# EAGLE schematic SchematicControlPlotter (EAGLE 9.1.2)
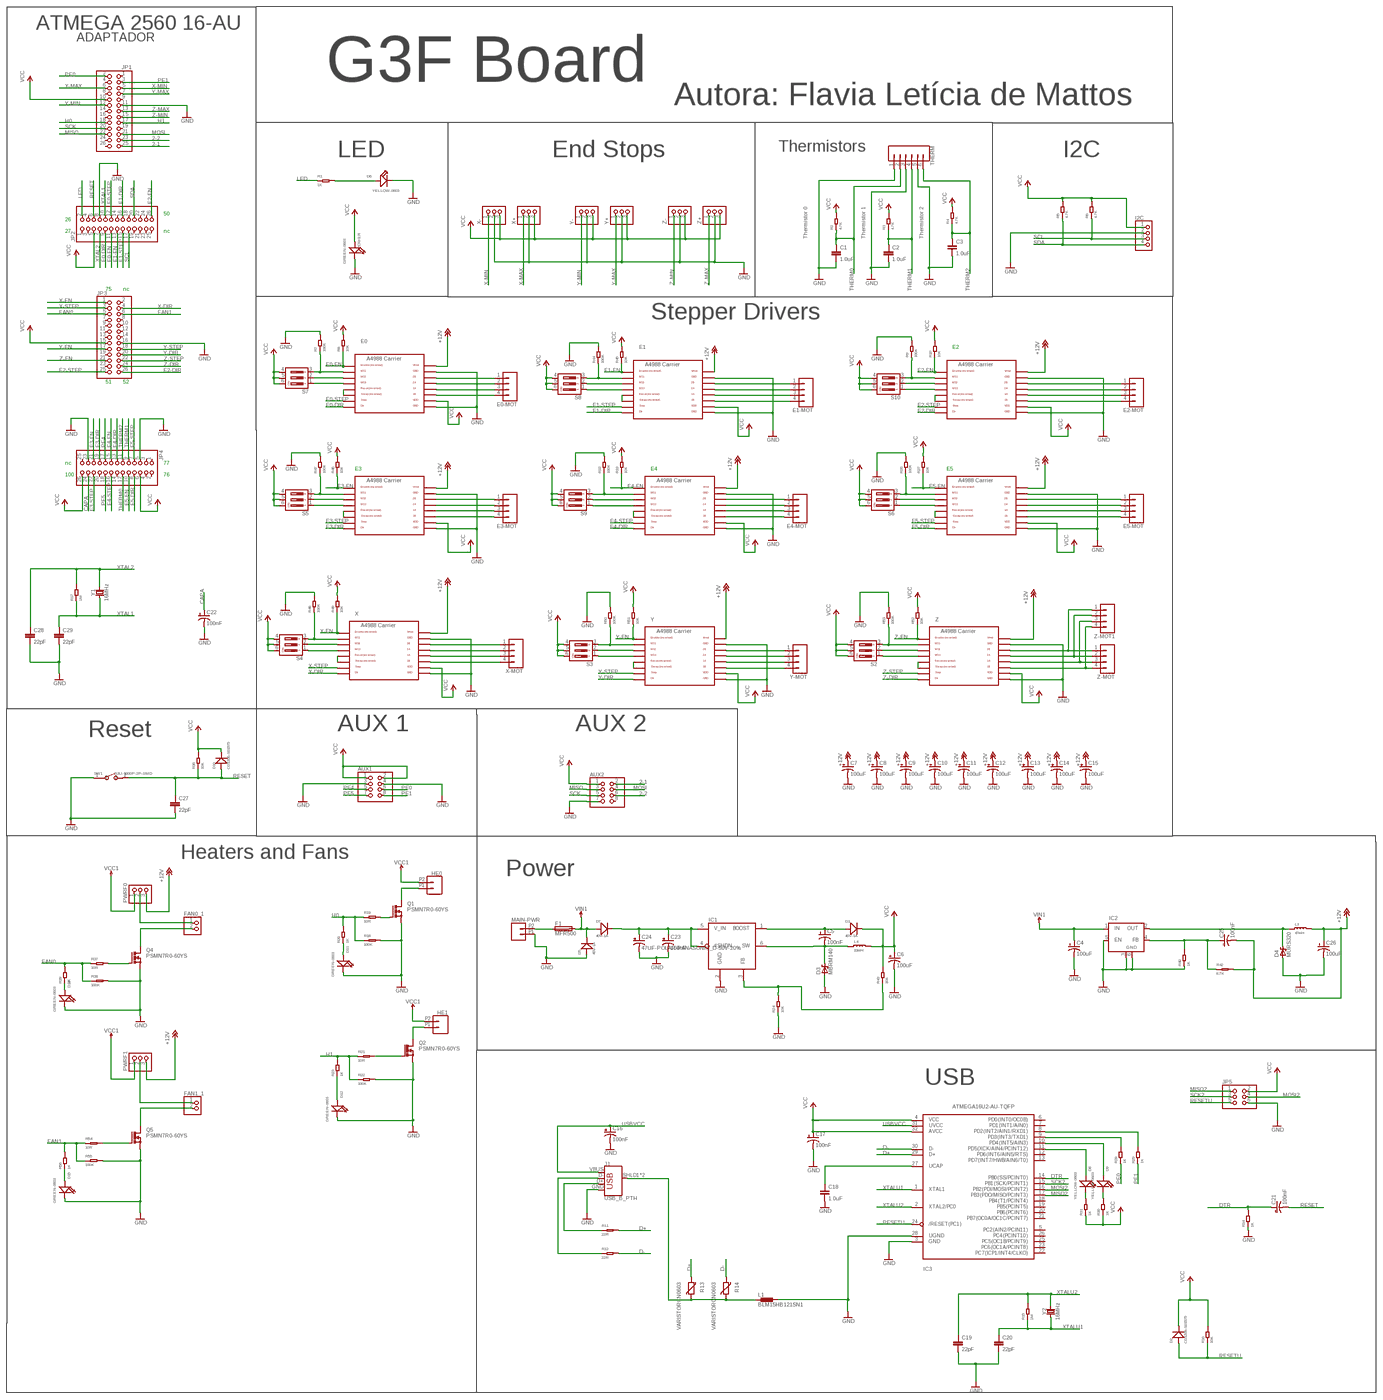
[diagram p0: schematic, sheet 1, overview]
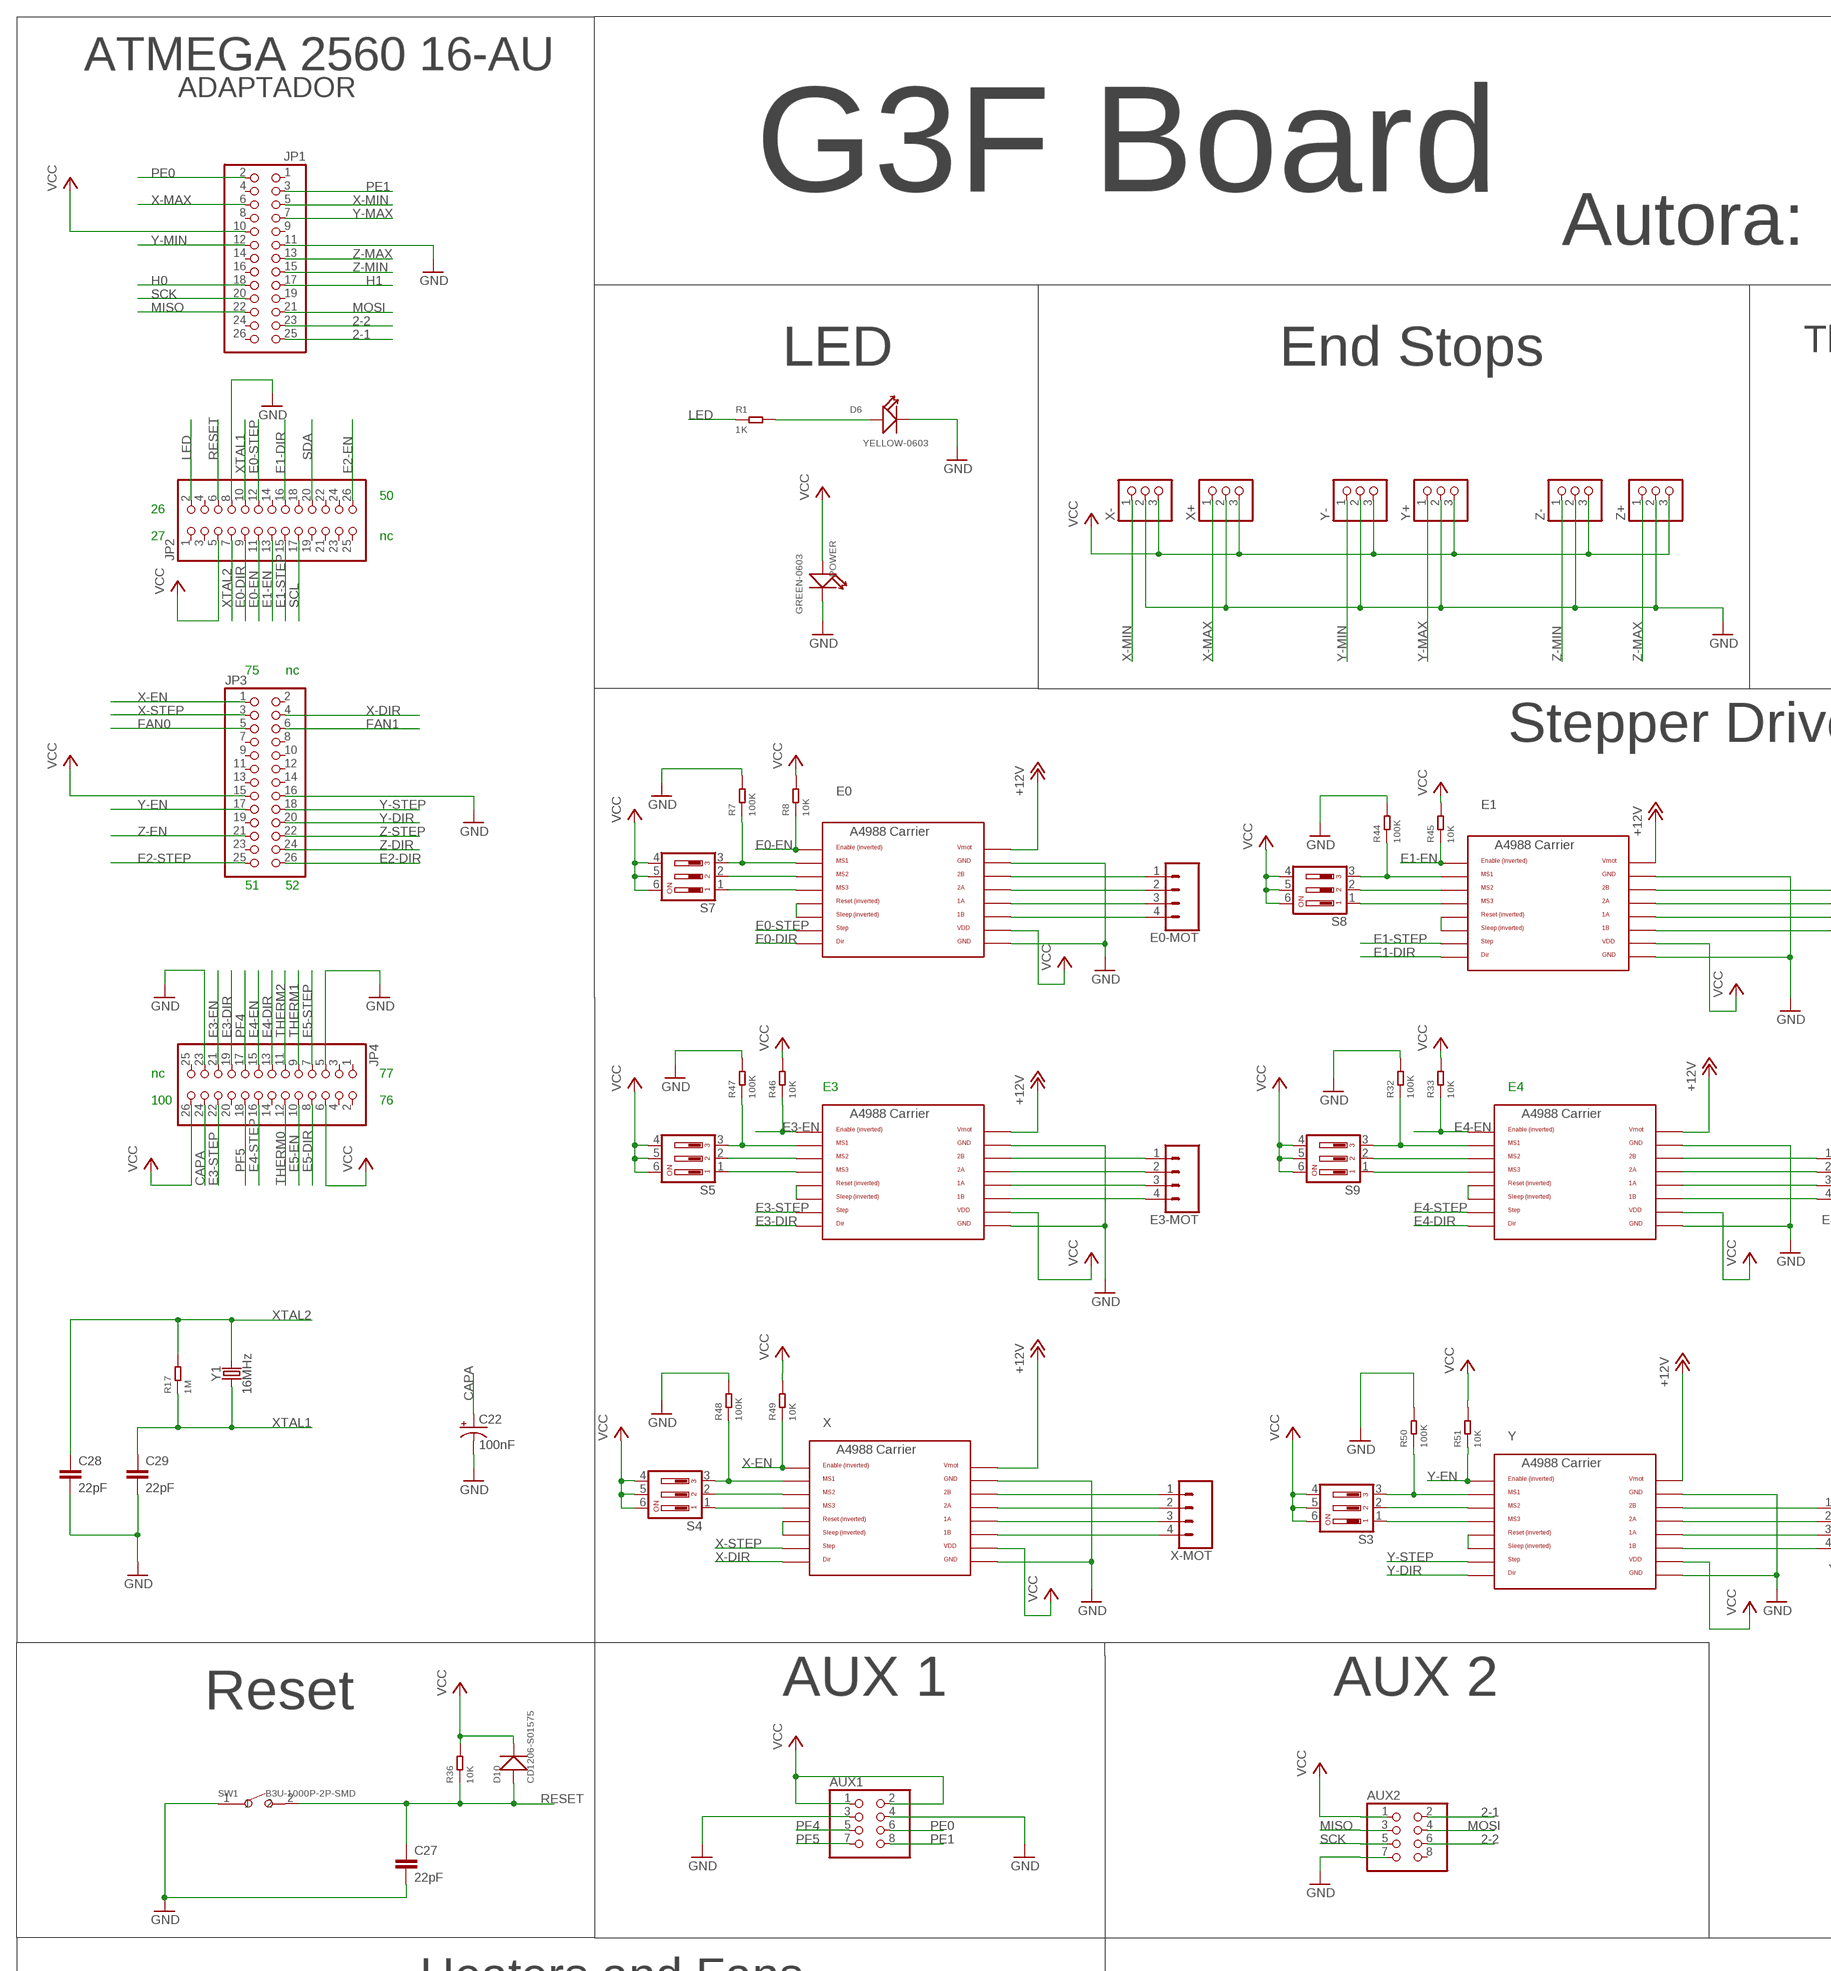
[diagram p1: schematic, sheet 1, part 1 of 4]
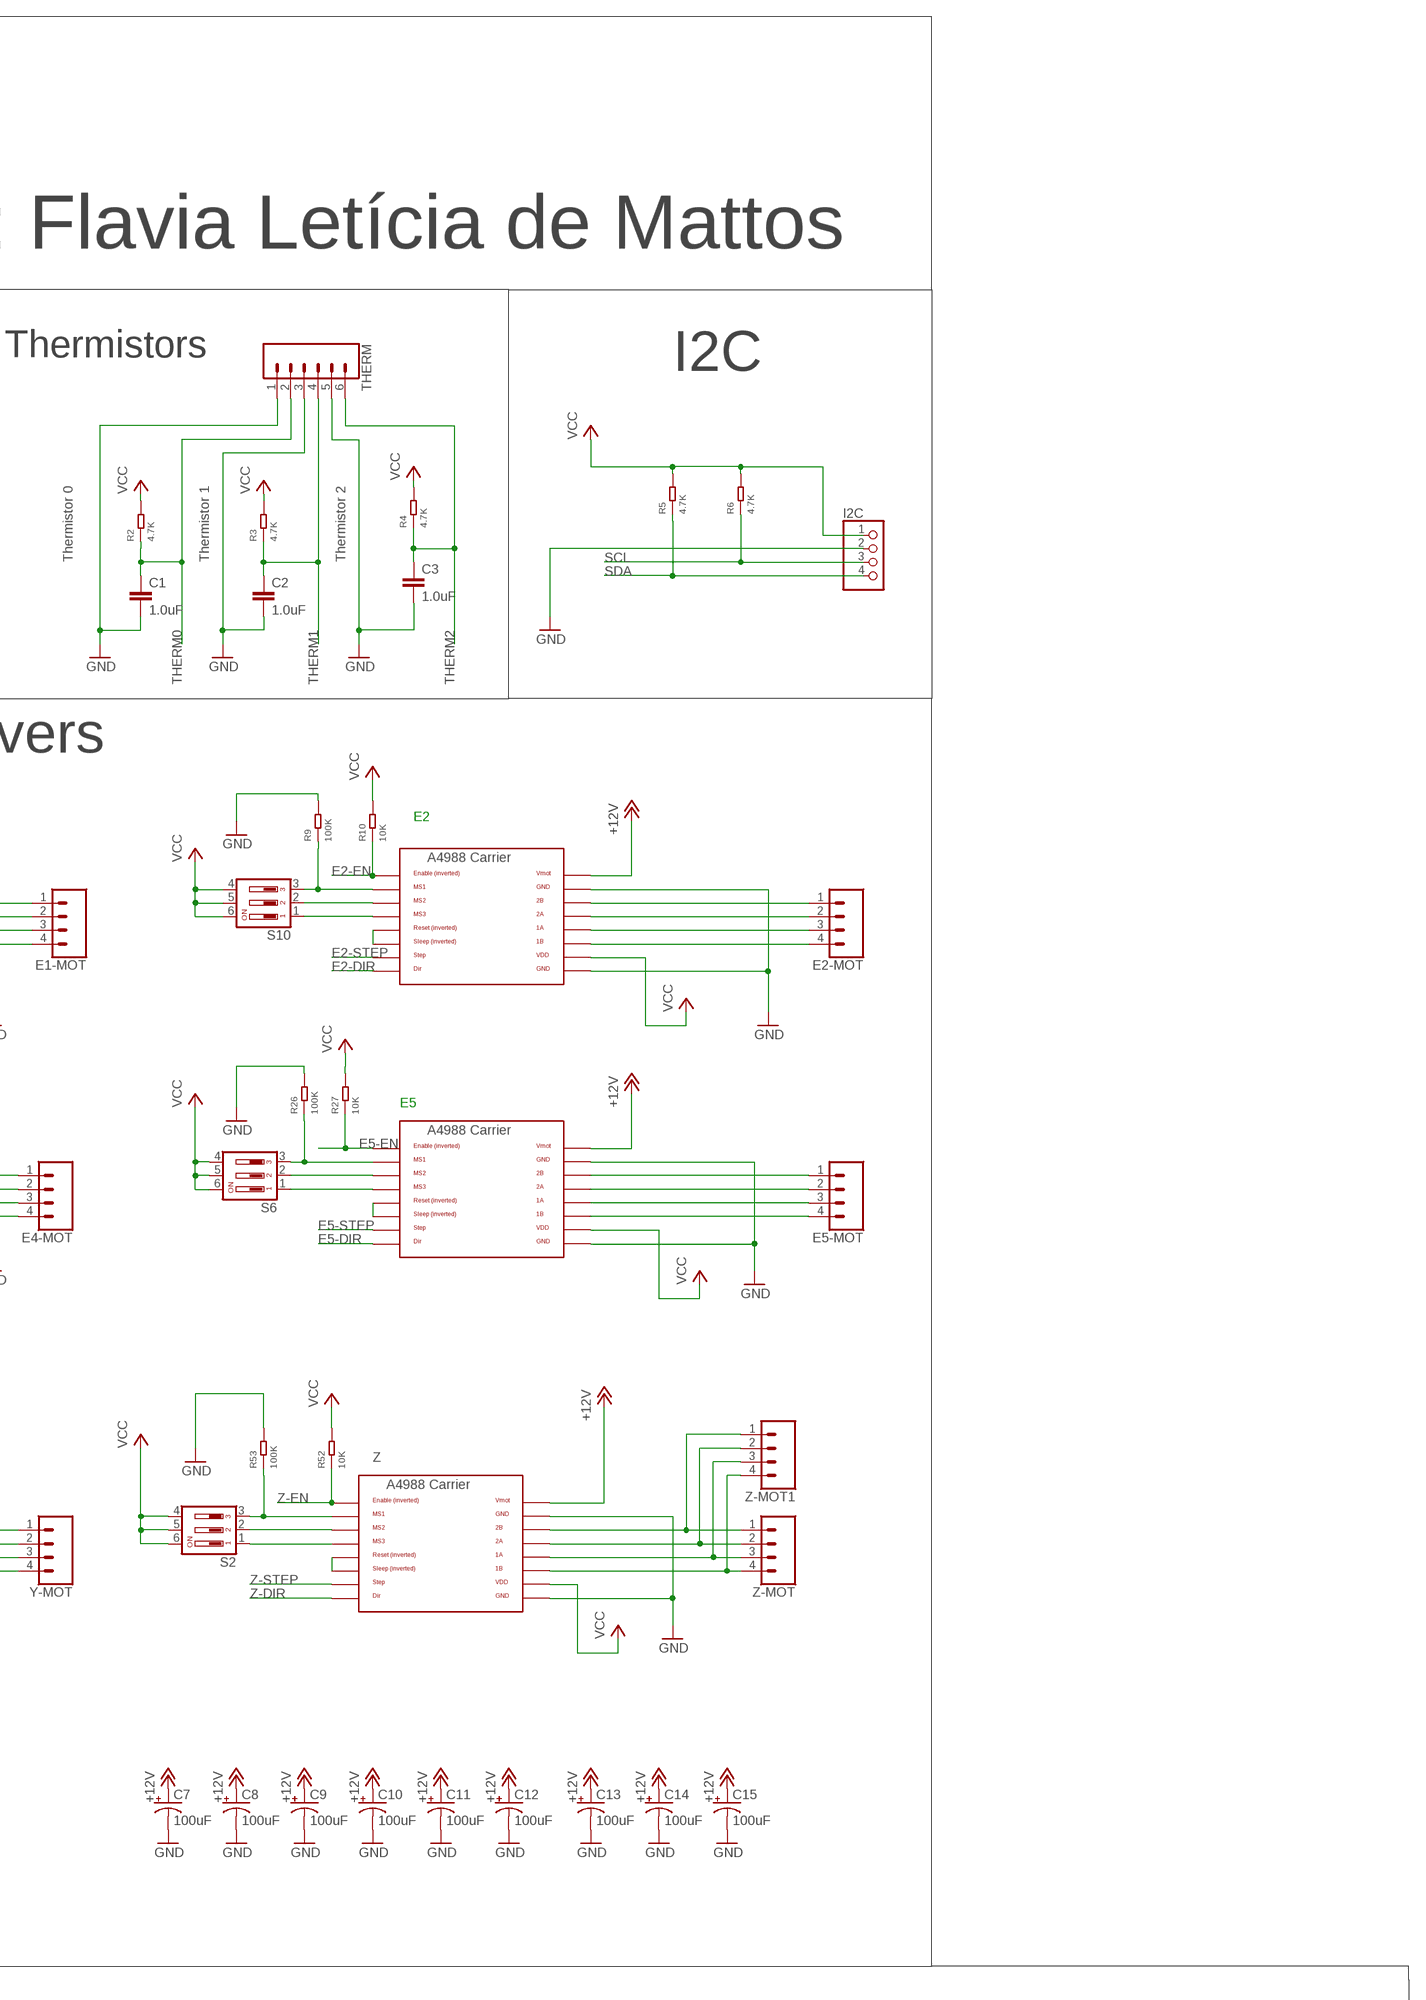
[diagram p2: schematic, sheet 1, part 2 of 4]
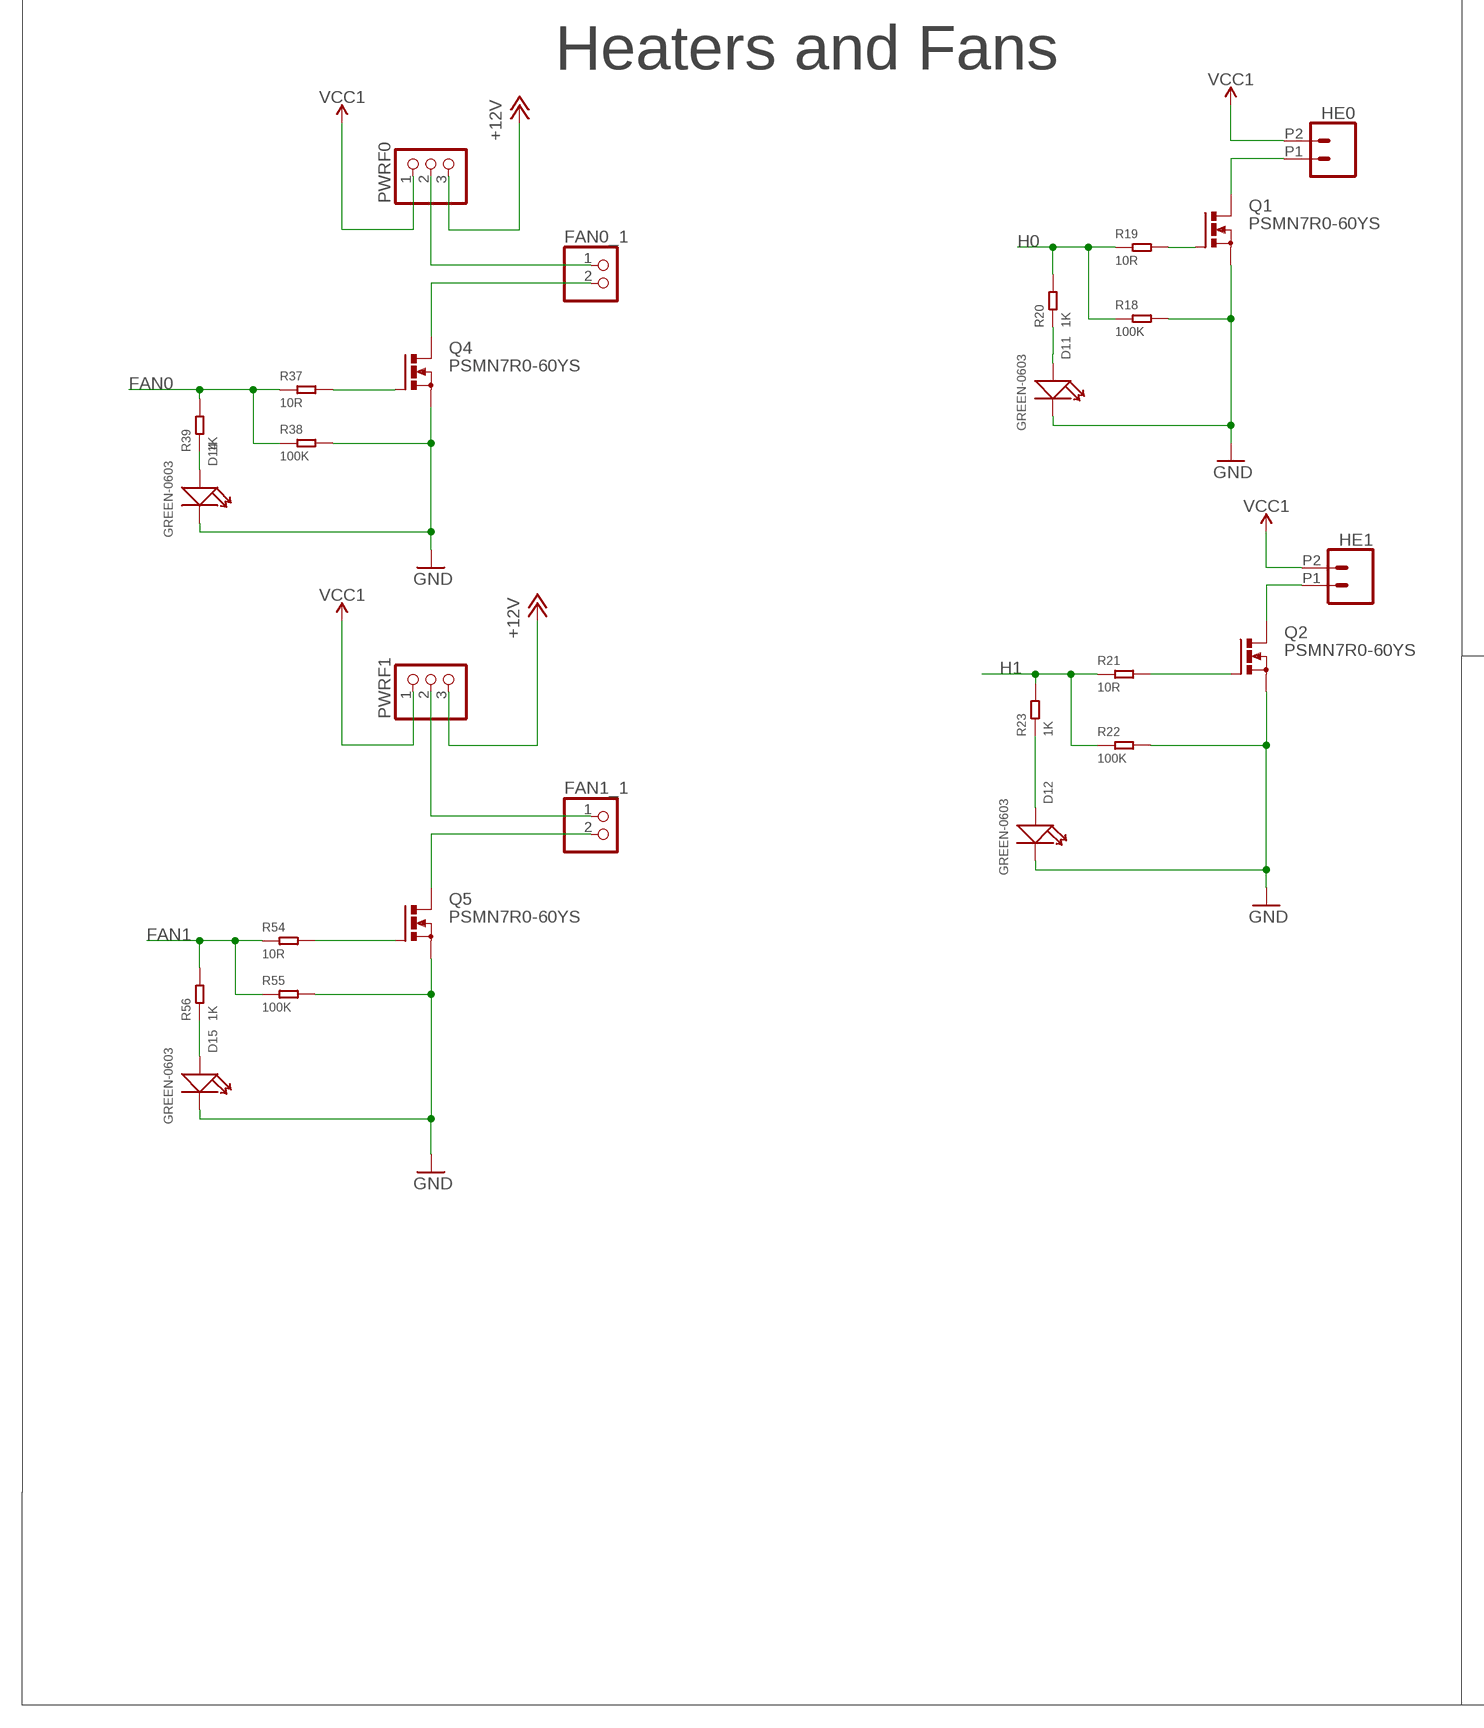
[diagram p3: schematic, sheet 1, part 3 of 4]
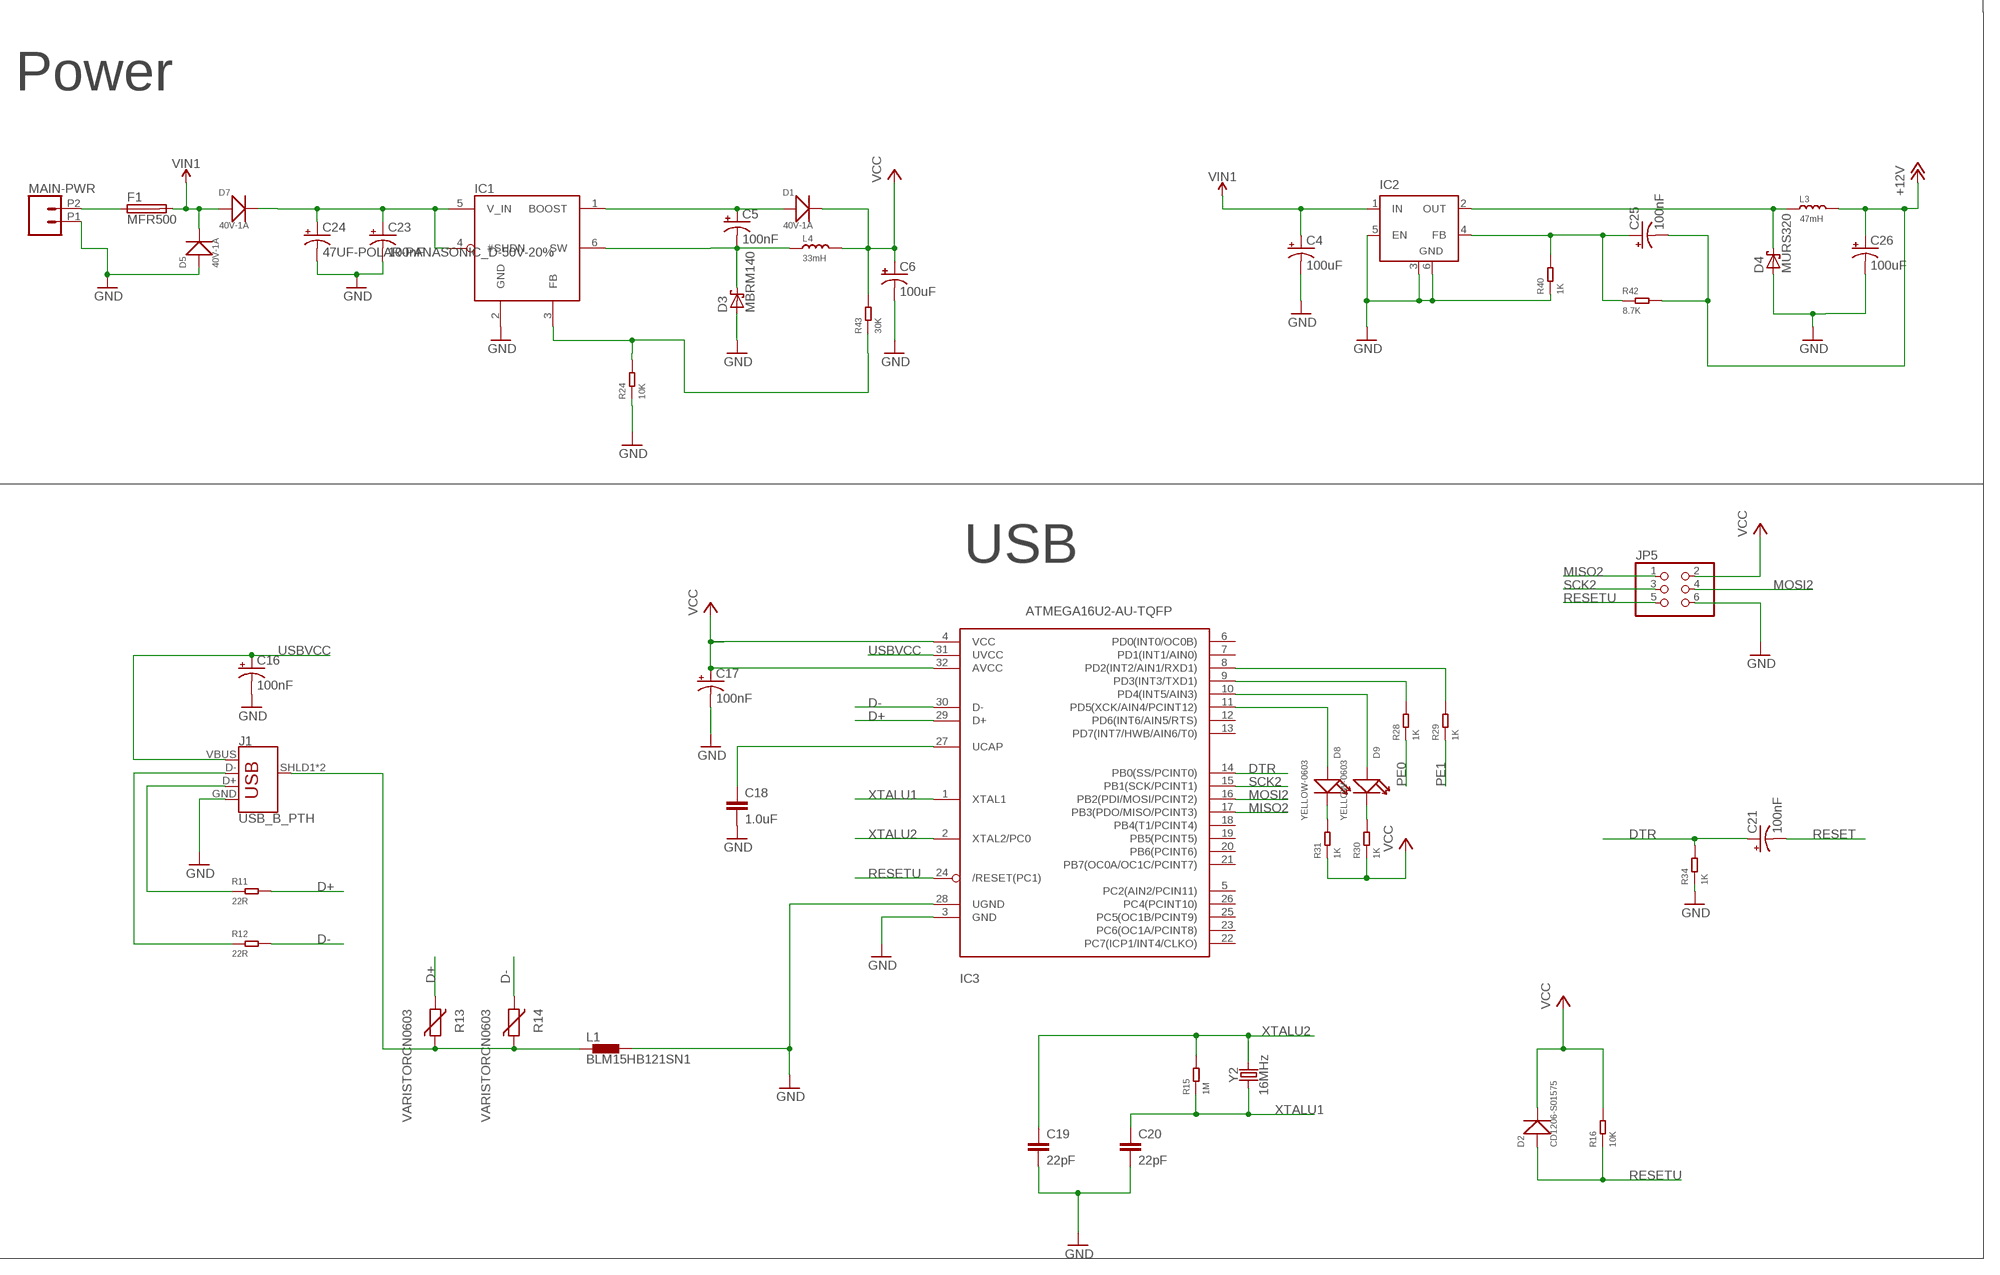
[diagram p4: schematic, sheet 1, part 4 of 4]

## Parts
AUX1  PINHD-2X4  [2X04]
AUX2  PINHD-2X4  [2X04]
C1  1.0uF  1.0UF-0805-25V-10%  [0805]
C2  1.0uF  1.0UF-0805-25V-10%  [0805]
C3  1.0uF  1.0UF-0805-25V-10%  [0805]
C4  100uF  100UF-POLAR-10X10.5-63V-20%  [NIC_10X10.5_CAP]
C5  100nF  100UF-POLAR-10X10.5-63V-20%  [NIC_10X10.5_CAP]
C6  100uF  100UF-POLAR-10X10.5-63V-20%  [NIC_10X10.5_CAP]
C7  100uF  100UF-POLAR-25V-20%(ELEC)  [PANASONIC_D]
C8  100uF  100UF-POLAR-25V-20%(ELEC)  [PANASONIC_D]
C9  100uF  100UF-POLAR-25V-20%(ELEC)  [PANASONIC_D]
C10  100uF  100UF-POLAR-25V-20%(ELEC)  [PANASONIC_D]
C11  100uF  100UF-POLAR-25V-20%(ELEC)  [PANASONIC_D]
C12  100uF  100UF-POLAR-25V-20%(ELEC)  [PANASONIC_D]
C13  100uF  100UF-POLAR-25V-20%(ELEC)  [PANASONIC_D]
C14  100uF  100UF-POLAR-25V-20%(ELEC)  [PANASONIC_D]
C15  100uF  100UF-POLAR-25V-20%(ELEC)  [PANASONIC_D]
C16  100nF  560UF-PANASONIC_G-25V-20%  [PANASONIC_G]
C17  100nF  560UF-PANASONIC_G-25V-20%  [PANASONIC_G]
C18  1.0uF  1.0UF-0603-16V-10%  [0603]
C19  22pF  22PF-0603-50V-5%  [0603]
C20  22pF  22PF-0603-50V-5%  [0603]
C21  100nF  560UF-PANASONIC_G-25V-20%  [PANASONIC_G]
C22  100nF  560UF-PANASONIC_G-25V-20%  [PANASONIC_G]
C23  100nF  560UF-PANASONIC_G-25V-20%  [PANASONIC_G]
C24  47UF-POLAR-PANASONIC_D-50V-20%  [PANASONIC_D]
C25  100nF  100UF-POLAR-10X10.5-63V-20%  [NIC_10X10.5_CAP]
C26  100uF  100UF-POLAR-10X10.5-63V-20%  [NIC_10X10.5_CAP]
C27  22pF  22PF-0603-50V-5%  [0603]
C28  22pF  22PF-0603-50V-5%  [0603]
C29  22pF  22PF-0603-50V-5%  [0603]
D1  40V-1A  SMD-DIODE-SCHOTTKY-40V-1A(DO-214AC)  [DO-214AC]
D2  CD1206-S01575  SMD-DIODE-SCHOTTKY-40V-1A(DO-214AC)  [DO-214AC]
D3  MBRM140  SCHOTTKY-DIODESMD  [SMB]
D4  MURS320  SCHOTTKY-DIODESMD  [SMB]
D5  40V-1A  SMD-DIODE-SCHOTTKY-40V-1A(DO-214AC)  [DO-214AC]
D6  YELLOW-0603  SMD-LED-CLEAR-YELLOW(0603)  [LED-0603]
D7  40V-1A  SMD-DIODE-SCHOTTKY-40V-1A(DO-214AC)  [DO-214AC]
D8  YELLOW-0603  SMD-LED-CLEAR-YELLOW(0603)  [LED-0603]
D9  YELLOW-0603  SMD-LED-CLEAR-YELLOW(0603)  [LED-0603]
D10  CD1206-S01575  SMD-DIODE-SCHOTTKY-40V-1A(DO-214AC)  [DO-214AC]
D11  GREEN-0603  SMD-LED-CLEAR-GREEN(0603)  [LED-0603]
D12  GREEN-0603  SMD-LED-CLEAR-GREEN(0603)  [LED-0603]
D14  GREEN-0603  SMD-LED-CLEAR-GREEN(0603)  [LED-0603]
D15  GREEN-0603  SMD-LED-CLEAR-GREEN(0603)  [LED-0603]
E0-MOT  CONN_04SCREW_LOCK  [SCREWTERMINAL-3.5MM-4_LOCK]
E1-MOT  CONN_04SCREW_LOCK  [SCREWTERMINAL-3.5MM-4_LOCK]
E2-MOT  CONN_04SCREW_LOCK  [SCREWTERMINAL-3.5MM-4_LOCK]
E3-MOT  CONN_04SCREW_LOCK  [SCREWTERMINAL-3.5MM-4_LOCK]
E4-MOT  CONN_04SCREW_LOCK  [SCREWTERMINAL-3.5MM-4_LOCK]
E5-MOT  CONN_04SCREW_LOCK  [SCREWTERMINAL-3.5MM-4_LOCK]
F1  MFR500  FUSELITTLEFUSE  [LITTLEFUSE]
FAN0_1  PINHD-1X2  [1X02]
FAN1_1  PINHD-1X2  [1X02]
HE0  CONN_022.54MM_SCREWTERM  [1X02_2.54_SCREWTERM]
HE1  CONN_022.54MM_SCREWTERM  [1X02_2.54_SCREWTERM]
I2C  PINHD-1X4  [1X04]
IC1  LT1933ES6  [SOT23-6]
IC2  LM2596S  [TO263-5]
IC3  ATMEGA16U2-AU-TQFP  [TQFP32-08]
J1  USB_B_PTH  [USB-B-PTH]
JP1  PINHD-2X13  [2X13]
JP2  PINHD-2X13  [2X13]
JP3  PINHD-2X13  [2X13]
JP4  PINHD-2X13  [2X13]
JP5  PINHD-2X3  [2X03]
L1  BLM15HB121SN1  [0402]
L3  47mH  SMD-INDUCTOR-4.7NH-0.3NH-300MA(0402)  [L0402]
L4  33mH  SMD-INDUCTOR-3.3NH-0.3NH-300MA(0402)  [L0402]
MAIN-PWR  CONN_022.54MM_SCREWTERM  [1X02_2.54_SCREWTERM]
POWER  GREEN-0603  SMD-LED-CLEAR-GREEN(0603)  [LED-0603]
PWRF0  PINHD-1X3  [1X03]
PWRF1  PINHD-1X3  [1X03]
Q1  PSMN7R0-60YS  PMOSFET_NTO220BH  [TO220BH]
Q2  PSMN7R0-60YS  PMOSFET_NTO220BH  [TO220BH]
Q4  PSMN7R0-60YS  PMOSFET_NTO220BH  [TO220BH]
Q5  PSMN7R0-60YS  PMOSFET_NTO220BH  [TO220BH]
R1  1K  SMD-RES-1K-1%-1/10W(0603)  [R0603]
R2  4.7K  SMD-RES-4.7K-5%-1/10W(0603)  [R0603]
R3  4.7K  SMD-RES-4.7K-5%-1/10W(0603)  [R0603]
R4  4.7K  SMD-RES-4.7K-5%-1/10W(0603)  [R0603]
R5  4.7K  SMD-RES-4.7K-5%-1/10W(0603)  [R0603]
R6  4.7K  SMD-RES-4.7K-5%-1/10W(0603)  [R0603]
R7  100K  SMD-RES-100K-1%-1/10W(0603)  [R0603]
R8  10K  SMD-RES-10K-1%-1/10W(0603)  [R0603]
R9  100K  SMD-RES-100K-1%-1/10W(0603)  [R0603]
R10  10K  SMD-RES-10K-1%-1/10W(0603)  [R0603]
R11  22R  SMD-RES-22R-5%-1/10W(0603)  [R0603]
R12  22R  SMD-RES-22R-5%-1/10W(0603)  [R0603]
R13  VARISTORCN0603  [CT/CN0603]
R14  VARISTORCN0603  [CT/CN0603]
R15  1M  SMD-RES-10M-1%-1/10W(0603)  [R0603]
R16  10K  SMD-RES-10K-1%-1/10W(0603)  [R0603]
R17  1M  SMD-RES-10M-1%-1/10W(0603)  [R0603]
R18  100K  SMD-RES-100K-1%-1/10W(0603)  [R0603]
R19  10R  SMD-RES-10R-1%-1/10W(0603)  [R0603]
R20  1K  SMD-RES-1K-1%-1/10W(0603)  [R0603]
R21  10R  SMD-RES-10R-1%-1/10W(0603)  [R0603]
R22  100K  SMD-RES-100K-1%-1/10W(0603)  [R0603]
R23  1K  SMD-RES-1K-1%-1/10W(0603)  [R0603]
R24  10K  SMD-RES-10K-1%-1/10W(0603)  [R0603]
R26  100K  SMD-RES-100K-1%-1/10W(0603)  [R0603]
R27  10K  SMD-RES-10K-1%-1/10W(0603)  [R0603]
R28  1K  SMD-RES-1K-1%-1/10W(0603)  [R0603]
R29  1K  SMD-RES-1K-1%-1/10W(0603)  [R0603]
R30  1K  SMD-RES-1K-1%-1/10W(0603)  [R0603]
R31  1K  SMD-RES-1K-1%-1/10W(0603)  [R0603]
R32  100K  SMD-RES-100K-1%-1/10W(0603)  [R0603]
R33  10K  SMD-RES-10K-1%-1/10W(0603)  [R0603]
R34  1K  SMD-RES-1K-1%-1/10W(0603)  [R0603]
R36  10K  SMD-RES-10K-1%-1/10W(0603)  [R0603]
R37  10R  SMD-RES-10R-1%-1/10W(0603)  [R0603]
R38  100K  SMD-RES-100K-1%-1/10W(0603)  [R0603]
R39  1K  SMD-RES-1K-1%-1/10W(0603)  [R0603]
R40  1K  SMD-RES-1K-5%-1/8W(0805)  [R0805]
R42  8.7K  SMD-RES-4.7K-5%-1/8W(0805)  [R0805]
R43  30K  SMD-RES-30K-1%-1/10W(0603)  [R0603]
R44  100K  SMD-RES-100K-1%-1/10W(0603)  [R0603]
R45  10K  SMD-RES-10K-1%-1/10W(0603)  [R0603]
R46  10K  SMD-RES-10K-1%-1/10W(0603)  [R0603]
R47  100K  SMD-RES-100K-1%-1/10W(0603)  [R0603]
R48  100K  SMD-RES-100K-1%-1/10W(0603)  [R0603]
R49  10K  SMD-RES-10K-1%-1/10W(0603)  [R0603]
R50  100K  SMD-RES-100K-1%-1/10W(0603)  [R0603]
R51  10K  SMD-RES-10K-1%-1/10W(0603)  [R0603]
R52  10K  SMD-RES-10K-1%-1/10W(0603)  [R0603]
R53  100K  SMD-RES-100K-1%-1/10W(0603)  [R0603]
R54  10R  SMD-RES-10R-1%-1/10W(0603)  [R0603]
R55  100K  SMD-RES-100K-1%-1/10W(0603)  [R0603]
R56  1K  SMD-RES-1K-1%-1/10W(0603)  [R0603]
S2  DP03  [DP-03]
S3  DP03  [DP-03]
S4  DP03  [DP-03]
S5  DP03  [DP-03]
S6  DP03  [DP-03]
S7  DP03  [DP-03]
S8  DP03  [DP-03]
S9  DP03  [DP-03]
S10  DP03  [DP-03]
SW1  B3U-1000P-2P-SMD  SMD-BUTTON(2P-3.0X2.5X1.2+0.4MM)-B3U-1000P-2P-SMD  [SW2-2.6-3.0X2.5X1.2+0.4MM]
THERM  CONN_063.5MM-6  [SCREWTERMINAL-3.5MM-6]
U$1  A4988BREAKOUT  [A4988BREAKOUT]
U$2  A4988BREAKOUT  [A4988BREAKOUT]
U$4  A4988BREAKOUT  [A4988BREAKOUT]
U$5  A4988BREAKOUT  [A4988BREAKOUT]
U$7  A4988BREAKOUT  [A4988BREAKOUT]
U$8  A4988BREAKOUT  [A4988BREAKOUT]
U$9  A4988BREAKOUT  [A4988BREAKOUT]
U$10  A4988BREAKOUT  [A4988BREAKOUT]
X  A4988BREAKOUT  [A4988BREAKOUT]
X+  PINHD-1X3  [1X03]
X-  PINHD-1X3  [1X03]
X-MOT  CONN_04SCREW_LOCK  [SCREWTERMINAL-3.5MM-4_LOCK]
Y1  16MHz  CRYSTAL-16MHZPTH-HC49US  [HC49US]
Y2  16MHz  CRYSTAL-16MHZPTH-HC49US  [HC49US]
Y+  PINHD-1X3  [1X03]
Y-  PINHD-1X3  [1X03]
Y-MOT  CONN_04SCREW_LOCK  [SCREWTERMINAL-3.5MM-4_LOCK]
Z+  PINHD-1X3  [1X03]
Z-  PINHD-1X3  [1X03]
Z-MOT  CONN_04SCREW_LOCK  [SCREWTERMINAL-3.5MM-4_LOCK]
Z-MOT1  CONN_04SCREW_LOCK  [SCREWTERMINAL-3.5MM-4_LOCK]

## Nets
2-1: AUX2.2 JP1.25
2-2: AUX2.6 JP1.23
+12V: C7.+ C8.+ C9.+ C10.+ C11.+ C12.+ C13.+ C14.+ C15.+ C25.- C26.+ L3.2 PWRF0.3 PWRF1.3 R42.2 U$1.VMOT U$2.VMOT U$4.VMOT U$5.VMOT U$7.VMOT U$8.VMOT U$9.VMOT U$10.VMOT X.VMOT
CAPA: C22.+ JP4.24
D+: IC3.29(D+) R11.2 R13.2
D-: IC3.30(D-) R12.2 R14.2
DTR: C21.+ IC3.14(PB0(SS/PCINT0)) R34.2
E0-DIR: JP2.9 U$1.DIR
E0-EN: JP2.11 R8.1 U$1.EN
E0-STEP: JP2.12 U$1.STEP
E1-DIR: JP2.16 U$2.DIR
E1-EN: JP2.13 R45.1 U$2.EN
E1-STEP: JP2.15 U$2.STEP
E2-DIR: JP3.26 U$7.DIR
E2-EN: JP2.26 R10.1 U$7.EN
E2-STEP: JP3.25 U$7.STEP
E3-DIR: JP4.19 U$8.DIR
E3-EN: JP4.21 R46.1 U$8.EN
E3-STEP: JP4.22 U$8.STEP
E4-DIR: JP4.13 U$9.DIR
E4-EN: JP4.15 R33.1 U$9.EN
E4-STEP: JP4.16 U$9.STEP
E5-DIR: JP4.8 U$10.DIR
E5-EN: JP4.10 R27.1 U$10.EN
E5-STEP: JP4.7 U$10.STEP
FAN0: JP3.5 R37.1 R38.1 R39.2
FAN1: JP3.6 R54.1 R55.1 R56.2
GND: AUX1.3 AUX1.4 AUX2.7 C1.2 C2.2 C3.2 C4.- C6.- C7.- C8.- C9.- C10.- C11.- C12.- C13.- C14.- C15.- C16.- C17.- C18.2 C19.2 C20.2 C22.- C23.- C24.- C26.- C27.2 C28.2 C29.2 D3.A D4.A D5.1(+) D6.- D11.- D12.- D14.- D15.- I2C.2 IC1.2(GND) IC2.3(GND) IC2.5(EN) IC2.6(GND) IC3.3(GND) IC3.28(UGND) J1.GND JP1.11 JP2.8 JP3.16 JP4.5 JP4.23 JP5.6 L1.2 MAIN-PWR.P1 POWER.- Q1.S Q2.S Q4.S Q5.S R7.2 R9.2 R18.2 R22.2 R24.1 R26.2 R32.2 R34.1 R38.2 R40.1 R44.2 R47.2 R48.2 R50.2 R53.2 R55.2 SW1.1 THERM.1 THERM.3 THERM.5 U$1.GND U$1.GND@0(GND) U$2.GND U$2.GND@0(GND) U$4.GND U$4.GND@0(GND) U$5.GND U$5.GND@0(GND) U$7.GND U$7.GND@0(GND) U$8.GND U$8.GND@0(GND) U$9.GND U$9.GND@0(GND) U$10.GND U$10.GND@0(GND) X+.2 X-.2 X.GND X.GND@0(GND) Y+.2 Y-.2 Z+.2 Z-.2
H0: JP1.18 R18.1 R19.1 R20.2
H1: JP1.17 R21.1 R22.1 R23.2
LED: JP2.2 R1.1
MISO: AUX2.3 JP1.22
MISO2: IC3.17(PB3(PDO/MISO/PCINT3)) JP5.1
MOSI: AUX2.4 JP1.21
MOSI2: IC3.16(PB2(PDI/MOSI/PCINT2)) JP5.4
N$1: D6.+ R1.2
N$2: R7.1 S7.3 U$1.MS1
N$3: R44.1 S8.3 U$2.MS1
N$4: S7.2 U$1.MS2
N$5: E0-MOT.1 U$1.2B
N$6: E0-MOT.2 U$1.2A
N$7: U$1.RST U$1.SLP(SLEEP)
N$8: E0-MOT.3 U$1.1A
N$9: E0-MOT.4 U$1.1B
N$10: S8.2 U$2.MS2
N$11: S8.1 U$2.MS3
N$12: R47.1 S5.3 U$8.MS1
N$13: E1-MOT.1 U$2.2B
N$14: E1-MOT.2 U$2.2A
N$15: U$2.RST U$2.SLP(SLEEP)
N$16: E1-MOT.3 U$2.1A
N$17: E1-MOT.4 U$2.1B
N$19: R48.1 S4.3 X.MS1
N$20: S4.2 X.MS2
N$21: HE0.P1 Q1.D
N$22: X-MOT.1 X.2B
N$23: X-MOT.2 X.2A
N$24: X-MOT.3 X.1A
N$25: X-MOT.4 X.1B
N$26: R53.1 S2.3 U$5.MS1
N$27: R50.1 S3.3 U$4.MS1
N$28: S3.2 U$4.MS2
N$29: S3.1 U$4.MS3
N$30: S4.1 X.MS3
N$31: R9.1 S10.3 U$7.MS1
N$32: S2.2 U$5.MS2
N$33: U$4.2B Y-MOT.1
N$34: U$4.2A Y-MOT.2
N$35: U$4.1A Y-MOT.3
N$36: U$4.1B Y-MOT.4
N$37: U$4.RST U$4.SLP(SLEEP)
N$38: S7.1 U$1.MS3
N$39: Q1.G R19.2
N$40: S10.2 U$7.MS2
N$41: U$5.RST U$5.SLP(SLEEP)
N$42: X.RST X.SLP(SLEEP)
N$43: S5.2 U$8.MS2
N$44: U$5.2A Z-MOT1.2 Z-MOT.2
N$45: U$5.1A Z-MOT1.3 Z-MOT.3
N$46: U$5.1B Z-MOT1.4 Z-MOT.4
N$47: S10.1 U$7.MS3
N$48: HE1.P1 Q2.D
N$49: D11.+ R20.1
N$50: FAN0_1.1 PWRF0.2
N$51: E3-MOT.1 U$8.2B
N$52: Q2.G R21.2
N$53: D12.+ R23.1
N$54: E2-MOT.1 U$7.2B
N$55: S5.1 U$8.MS3
N$56: E2-MOT.2 U$7.2A
N$57: E2-MOT.3 U$7.1A
N$58: E2-MOT.4 U$7.1B
N$59: E3-MOT.2 U$8.2A
N$60: U$7.RST U$7.SLP(SLEEP)
N$61: E3-MOT.3 U$8.1A
N$62: E3-MOT.4 U$8.1B
N$63: R26.1 S6.3 U$10.MS1
N$64: S2.1 U$5.MS3
N$65: S6.2 U$10.MS2
N$66: U$8.RST U$8.SLP(SLEEP)
N$67: U$9.RST U$9.SLP(SLEEP)
N$68: R32.1 S9.3 U$9.MS1
N$69: S9.2 U$9.MS2
N$70: S9.1 U$9.MS3
N$71: E4-MOT.1 U$9.2B
N$72: E4-MOT.2 U$9.2A
N$73: E4-MOT.3 U$9.1A
N$74: E4-MOT.4 U$9.1B
N$75: E5-MOT.1 U$10.2B
N$76: E5-MOT.2 U$10.2A
N$77: E5-MOT.3 U$10.1A
N$78: E5-MOT.4 U$10.1B
N$79: F1.1 MAIN-PWR.P2
N$80: S6.1 U$10.MS3
N$84: D4.C IC2.2(OUT) L3.1
N$85: J1.D- R12.1
N$86: U$10.RST U$10.SLP(SLEEP)
N$87: J1.D+ R11.1
N$88: J1.SHLD1(SHIELD) J1.SHLD2(SHIELD) L1.1 R13.1 R14.1
N$89: IC3.8(PD2(INT2/AIN1/RXD1)) R29.2
N$90: C23.+ C24.+ D7.2(-) IC1.4(#SHDN) IC1.5(V_IN)
N$91: FAN1_1.1 PWRF1.2
N$92: FAN1_1.2 Q5.D
N$93: C25.+ IC2.4(FB) R40.2 R42.1
N$94: U$5.2B Z-MOT1.1 Z-MOT.1
N$95: C5.+ D1.1(+) IC1.1(BOOST)
N$96: C5.- D3.C IC1.6(SW) L4.1
N$97: IC3.9(PD3(INT3/TXD1)) R28.2
N$98: FAN0_1.2 Q4.D
N$99: C18.1 IC3.27(UCAP)
N$100: D9.+ IC3.10(PD4(INT5/AIN3))
N$101: IC1.3(FB) R24.2 R43.1
N$102: D8.+ IC3.11(PD5(XCK/AIN4/PCINT12))
N$103: D8.- R31.2
N$104: D9.- R30.2
N$105: Q4.G R37.2
N$106: Q5.G R54.2
N$107: D14.+ R39.1
N$109: D15.+ R56.1
PE0: AUX1.6 JP1.2 R28.1
PE1: AUX1.8 JP1.3 R29.1
PF4: AUX1.5 JP4.17
PF5: AUX1.7 JP4.18
RESET: C21.- C27.1 D10.1(+) JP2.6 R36.1 SW1.2
RESETU: D2.1(+) IC3.24(/RESET(PC1)) JP5.5 R16.1
SCK: AUX2.5 JP1.20
SCK2: IC3.15(PB1(SCK/PCINT1)) JP5.3
SCL: I2C.3 JP2.17 R6.1
SDA: I2C.4 JP2.20 R5.1
THERM0: C1.1 JP4.12 R2.1 THERM.2
THERM1: C2.1 JP4.9 R3.1 THERM.4
THERM2: C3.1 JP4.11 R4.1 THERM.6
USBVCC: C16.+ IC3.31(UVCC) J1.VBUS
VCC: AUX1.1 AUX1.2 AUX2.1 C4.+ C6.+ C17.+ D1.2(-) D2.2(-) D5.2(-) D7.1(+) D10.2(-) F1.2 I2C.1 IC2.1(IN) IC3.4(VCC) IC3.32(AVCC) JP1.10 JP2.5 JP3.15 JP4.6 JP4.26 JP5.2 L4.2 POWER.+ R2.2 R3.2 R4.2 R5.2 R6.2 R8.2 R10.2 R16.2 R27.2 R30.1 R31.1 R33.2 R36.2 R43.2 R45.2 R46.2 R49.2 R51.2 R52.2 S2.4 S2.5 S2.6 S3.4 S3.5 S3.6 S4.4 S4.5 S4.6 S5.4 S5.5 S5.6 S6.4 S6.5 S6.6 S7.4 S7.5 S7.6 S8.4 S8.5 S8.6 S9.4 S9.5 S9.6 S10.4 S10.5 S10.6 U$1.VDD U$2.VDD U$4.VDD U$5.VDD U$7.VDD U$8.VDD U$9.VDD U$10.VDD X+.3 X-.3 X.VDD Y+.3 Y-.3 Z+.3 Z-.3 ; supply symbol labelled VIN1
VCC_1: HE0.P2 HE1.P2 PWRF0.1 PWRF1.1 ; supply symbol labelled VCC1
X-DIR: JP3.4 X.DIR
X-EN: JP3.1 R49.1 X.EN
X-MAX: JP1.6 X+.1
X-MIN: JP1.5 X-.1
X-STEP: JP3.3 X.STEP
XTAL1: C29.1 JP2.10 R17.1 Y1.1
XTAL2: C28.1 JP2.7 R17.2 Y1.2
XTALU1: C20.1 IC3.1(XTAL1) R15.1 Y2.1
XTALU2: C19.1 IC3.2(XTAL2/PC0) R15.2 Y2.2
Y-DIR: JP3.20 U$4.DIR
Y-EN: JP3.17 R51.1 U$4.EN
Y-MAX: JP1.7 Y+.1
Y-MIN: JP1.12 Y-.1
Y-STEP: JP3.18 U$4.STEP
Z-DIR: JP3.24 U$5.DIR
Z-EN: JP3.21 R52.1 U$5.EN
Z-MAX: JP1.13 Z+.1
Z-MIN: JP1.15 Z-.1
Z-STEP: JP3.22 U$5.STEP
Unconnected: AUX2.8 IC3.5(PC2(AIN2/PCIN11)) IC3.6(PD0(INT0/OC0B)) IC3.7(PD1(INT1/AIN0)) IC3.12(PD6(INT6/AIN5/RTS)) IC3.13(PD7(INT7/HWB/AIN6/T0)) IC3.18(PB4(T1/PCINT4)) IC3.19(PB5(PCINT5)) IC3.20(PB6(PCINT6)) IC3.21(PB7(OC0A/OC1C/PCINT7)) IC3.22(PC7(ICP1/INT4/CLKO)) IC3.23(PC6(OC1A/PCINT8)) IC3.25(PC5(OC1B/PCINT9)) IC3.26(PC4(PCINT10)) JP1.1 JP1.4 JP1.8 JP1.9 JP1.14 JP1.16 JP1.19 JP1.24 JP1.26 JP2.1 JP2.3 JP2.4 JP2.14 JP2.18 JP2.19 JP2.21 JP2.22 JP2.23 JP2.24 JP2.25 JP3.2 JP3.7 JP3.8 JP3.9 JP3.10 JP3.11 JP3.12 JP3.13 JP3.14 JP3.19 JP3.23 JP4.1 JP4.2 JP4.3 JP4.4 JP4.14 JP4.20 JP4.25

## Notes on the sheet
- ATMEGA 2560 16-AU
- ADAPTADOR
- G3F Board
- Autora: Flavia Letícia de Mattos
- Thermistors
- LED | End Stops | I2C
- 50
- 26
- 27 | nc
- Thermistor 0 | Thermistor 1 | Thermistor 2
- 75 | nc
- Stepper Drivers
- E0
- E1 | E2
- 51 | 52
- nc | 77
- E3 | E4 | E5
- 100 | 76
- X
- Y | Z
- Reset | AUX 1 | AUX 2
- Heaters and Fans
- Power
- USB

## Library data of the parts
AUX1 AUX2 = pinhead:PINHD-2X4: PIN HEADER
C1-C3 = SparkFun-Capacitors:1.0UF: 1µF ceramic capacitors A capacitor is a passive two-terminal electrical component used to store electrical energy temporarily in an electric field.; PROD_ID: CAP-08064
C4 C6 C26 = SparkFun-Capacitors:100UF-POLAR: 100µF polarized capacitors A capacitor is a passive two-terminal electrical component used to store electrical energy temporarily in an electric field.; PROD_ID: CAP-08362
C5 C25 = SparkFun-Capacitors:100UF-POLAR: 100µF polarized capacitors A capacitor is a passive two-terminal electrical component used to store electrical energy temporarily in an electric field.; PROD_ID: CAP-08362; VALUE: 100uF
C7-C15 = SparkFun-Capacitors:100UF-POLAR: 100µF polarized capacitors A capacitor is a passive two-terminal electrical component used to store electrical energy temporarily in an electric field.; PROD_ID: CAP-12547
C16 C17 C21-C23 = SparkFun-Capacitors:560UF: 560µF polarized capacitors A capacitor is a passive two-terminal electrical component used to store electrical energy temporarily in an electric field.; PROD_ID: CAP-09983; VALUE: 560uF
C18 = SparkFun-Capacitors:1.0UF: 1µF ceramic capacitors A capacitor is a passive two-terminal electrical component used to store electrical energy temporarily in an electric field.; PROD_ID: CAP-00868
C19 C20 C27-C29 = SparkFun-Capacitors:22PF: 22pF ceramic capacitors A capacitor is a passive two-terminal electrical component used to store electrical energy temporarily in an electric field.; PROD_ID: CAP-07876
C24 = SparkFun-Capacitors:47UF-POLAR: 47µF polarized capacitors A capacitor is a passive two-terminal electrical component used to store electrical energy temporarily in an electric field.
D1 D5 D7 = Seeed-Diode:SMD-DIODE-SCHOTTKY-40V-1A(DO-214AC): 304020027; MPN: 1N5819
D2 D10 = Seeed-Diode:SMD-DIODE-SCHOTTKY-40V-1A(DO-214AC): 304020027; MPN: 1N5819; VALUE: 40V-1A
D3 D4 = diode:SCHOTTKY-DIODE: Schottky Diode
D6 D8 D9 = Seeed-LED:SMD-LED-CLEAR-YELLOW(0603): 304090044; MPN: 19-217-Y5C-AM1N1VY-3T
D11 D12 D14 D15 POWER = Seeed-LED:SMD-LED-CLEAR-GREEN(0603): 304090043; MPN: 19-217-G7C-AN1P2-3T
E0-MOT E1-MOT E2-MOT E3-MOT E4-MOT E5-MOT X-MOT Y-MOT Z-MOT Z-MOT1 = SparkFun-Connectors:CONN_04: Multi connection point. Often used as Generic Header-pin footprint for 0.1 inch spaced/style header connections On any of the 0.1 inch spaced packages, you can populate with these: Break Away Headers - Straight <https://www.sparkfun.com/products/116> (PRT-00116) Break Away Male Headers - Right Angle <https://www.sparkfun.com/products/553> (PRT-00553) Female Headers <https://www.sparkfun.com/products/115> (PRT-00115) Break Away Headers - Machine Pin <https://www.sparkfun.com/products/117> (PRT-00117) Break Away Female Headers - Swiss Machine Pin <https://www.sparkfun.com/products/743> (PRT-00743) For SCREWTERMINALS and SPRING TERMINALS visit here: Screw Terimnals on SparkFun.com <https://www.sparkfun.com/search/results?term=Screw+Terminals> (5mm/3.5mm/2.54mm spacing) This device is also useful as a general connection point to wire up your design to another part of your project. Our various solder wires solder well into these plated through hole pads. Hook-Up Wire - Assortment (Stranded, 22 AWG) <https://www.sparkfun.com/products/11375> (PRT-11375) Hook-Up Wire - Assortment (Solid Core, 22 AWG) <https://www.sparkfun.com/products/11367> (PRT-11367) View the entire wire category on our website here <https://www.sparkfun.com/categories/141> Special notes: Molex polarized connector foot print use with SKU : PRT-08231 with associated crimp pins and housings. 1MM SMD Version SKU: PRT-10208
F1 = fuse:FUSE: Fuse; OC_FARNELL: unknown; OC_NEWARK: unknown
FAN0_1 FAN1_1 = pinhead:PINHD-1X2: PIN HEADER
HE0 HE1 MAIN-PWR = SparkFun-Connectors:CONN_02: Multi connection point. Often used as Generic Header-pin footprint for 0.1 inch spaced/style header connections On any of the 0.1 inch spaced packages, you can populate with these: Break Away Headers - Straight <https://www.sparkfun.com/products/116> (PRT-00116) Break Away Male Headers - Right Angle <https://www.sparkfun.com/products/553> (PRT-00553) Female Headers <https://www.sparkfun.com/products/115> (PRT-00115) Break Away Headers - Machine Pin <https://www.sparkfun.com/products/117> (PRT-00117) Break Away Female Headers - Swiss Machine Pin <https://www.sparkfun.com/products/743> (PRT-00743) For SCREWTERMINALS and SPRING TERMINALS visit here: Screw Terimnals on SparkFun.com <https://www.sparkfun.com/search/results?term=Screw+Terminals> (5mm/3.5mm/2.54mm spacing) This device is also useful as a general connection point to wire up your design to another part of your project. Our various solder wires solder well into these plated through hole pads. Hook-Up Wire - Assortment (Stranded, 22 AWG) <https://www.sparkfun.com/products/11375> (PRT-11375) Hook-Up Wire - Assortment (Solid Core, 22 AWG) <https://www.sparkfun.com/products/11367> (PRT-11367) View the entire wire category on our website here <https://www.sparkfun.com/categories/141> Special notes: Molex polarized connector foot print use with: PRT-08233 with associated crimp pins and housings. 2.54_SCREWTERM for use with PRT-10571. 3.5mm Screw Terminal footprints for PRT-08084 5mm Screw Terminal footprints for use with PRT-08432
I2C = RepRapjr:PINHD-1X4: PIN HEADER
IC1 = ltc_swr:LT1933: LT1933 - 600mA, 500kHz Step-Down Switching Regulator in SOT-23 Wide Input Range: 3.6V to 36V 5V at 600mA from 16V to 36V Input 3.3V at 600mA from 12V to 36V Input 5V at 500mA from 6.3V to 36V Input 3.3V at 500mA from 4.5V to 36V Input Fixed Frequency 500kHz Operation Uses Tiny Capacitors and Inductors Soft-Start Internally Compensated Low Shutdown Current: <2µA Output Adjustable Down to 1.25V Low Profile (1mm) SOT-23 (ThinSOT™) and (2mm x 3mm x 0.75mm) 6-Pin DFN Packages
IC2 = linear:LM2596S: STEP-DOWN VOLTAGE REGULATOR
IC3 = ChicagoRobotics:ATMEGA16U2-AU: ATmega32u2 Pin compatible with the atmega8u2, atmega16u2 and atmega32u2 8, 16 or 32 K flash, 1K RAM, 512b EEPROM 8 bit and 16 bit timer (5 PWM total) UART, SPI (no I2C!) USB with 4 endpoints, LUFA compatible 22 I/O lines, analog comparator (no ADC!) Comes with DFU bootloader burned in!
J1 = SparkFun-Connectors:USB_B: USB Type B Connector SparkFun Products: SparkFun Stepoko <https://www.sparkfun.com/products/13899> PTH; PROD_ID: CONN-08278; SF_ID: PRT-00139
JP1-JP4 = pinhead:PINHD-2X13: PIN HEADER
JP5 = pinhead:PINHD-2X3: PIN HEADER
L1 = inductors:BLM15H: EMIFIL (R) Chip Ferrite Bead for GHz Noise Source: http://www.murata.com/ Ferrite Bead BLM15H.pdf
L3 = Seeed-Inductor:SMD-INDUCTOR-4.7NH-0.3NH-300MA(0402): 303010037; MPN: LQG15HS4N7S02; VALUE: 4.7NH-300MA
L4 = Seeed-Inductor:SMD-INDUCTOR-3.3NH-0.3NH-300MA(0402): 303010056; VALUE: 3.3NH- 300MA
PWRF0 PWRF1 X+ X- Y+ Y- Z+ Z- = pinhead:PINHD-1X3: PIN HEADER
Q1 Q2 Q4 Q5 = transistor-power:PMOSFET_N: Power MOSFET N-Channel
R1 R20 R23 R28-R31 R34 R39 R56 = Seeed-Resistor:SMD-RES-1K-1%-1/10W(0603): 301010298; MPN: RC0603FR-071KL
R2-R6 = Seeed-Resistor:SMD-RES-4.7K-5%-1/10W(0603): 301010290; MPN: RC0603JR-074K7L
R7 R9 R18 R22 R26 R32 R38 R44 R47 R48 R50 R53 R55 = Seeed-Resistor:SMD-RES-100K-1%-1/10W(0603): 301010196; MPN: RC0603FR-07100KL
R8 R10 R16 R24 R27 R33 R36 R45 R46 R49 R51 R52 = Seeed-Resistor:SMD-RES-10K-1%-1/10W(0603): 301010299; MPN: RC0603FR-0710KL
R11 R12 = Seeed-Resistor:SMD-RES-22R-5%-1/10W(0603): 301010289; MPN: RC0603JR-0722RL
R13 R14 = varistor:VARISTOR: VARISTOR
R15 R17 = Seeed-Resistor:SMD-RES-10M-1%-1/10W(0603): 301010153; MPN: RC0603FR-0710ML; VALUE: 10M
R19 R21 R37 R54 = Seeed-Resistor:SMD-RES-10R-1%-1/10W(0603): 301010185; MPN: RC0603FR-0710RL
R40 = Seeed-Resistor:SMD-RES-1K-5%-1/8W(0805): 301010311; MPN: RC0805JR-071KL
R42 = Seeed-Resistor:SMD-RES-4.7K-5%-1/8W(0805): 301010306; MPN: RC0805JR-074K7L; VALUE: 4.7K
R43 = Seeed-Resistor:SMD-RES-30K-1%-1/10W(0603): 301010202; MPN: RC0603FR-0730KL
S2-S10 = switch-dil:DP03: DIL/CODE SWITCH; MPN: MCDP03; OC_FARNELL: 1522004; OC_NEWARK: 74M2976
SW1 = Seeed-Switch:SMD-BUTTON(2P-3.0X2.5X1.2+0.4MM): 311020047; MPN: B3U-1000P-2P-SMD
THERM = SparkFun-Connectors:CONN_06: Multi connection point. Often used as Generic Header-pin footprint for 0.1 inch spaced/style header connections On any of the 0.1 inch spaced packages, you can populate with these: Break Away Headers - Straight <https://www.sparkfun.com/products/116> (PRT-00116) Break Away Male Headers - Right Angle <https://www.sparkfun.com/products/553> (PRT-00553) Female Headers <https://www.sparkfun.com/products/115> (PRT-00115) Break Away Headers - Machine Pin <https://www.sparkfun.com/products/117> (PRT-00117) Break Away Female Headers - Swiss Machine Pin <https://www.sparkfun.com/products/743> (PRT-00743) Arduino Stackable Header - 6 Pin <https://www.sparkfun.com/products/9280> (PRT-09280) For SCREWTERMINALS and SPRING TERMINALS visit here: Screw Terimnals on SparkFun.com <https://www.sparkfun.com/search/results?term=Screw+Terminals> (5mm/3.5mm/2.54mm spacing) This device is also useful as a general connection point to wire up your design to another part of your project. Our various solder wires solder well into these plated through hole pads. Hook-Up Wire - Assortment (Stranded, 22 AWG) <https://www.sparkfun.com/products/11375> (PRT-11375) Hook-Up Wire - Assortment (Solid Core, 22 AWG) <https://www.sparkfun.com/products/11367> (PRT-11367) View the entire wire category on our website here <https://www.sparkfun.com/categories/141>
U$1 U$2 U$4 U$5 U$7-U$10 X = RepRapjr:A4988BREAKOUT
Y1 Y2 = SparkFun-Clocks:CRYSTAL-16MHZ: 16MHz Crystal Digikey Example <http://www.digikey.com/product-search/en?keywords=535-9122-1-ND> Frequency: 16MHz Frequency Stability: ±50ppm Frequency Tolerance: ±20ppm Load Capacitance: 18pF SparkFun Products: Pro Micro -5V/16MHz <https://www.sparkfun.com/products/12640> SparkFun Serial Enabled LCD Kit <https://www.sparkfun.com/products/10097>; PROD_ID: XTAL-08181; SF_ID: COM-00536